# EAGLE schematic EARM01 (EAGLE 7.2.0)

## Sheet 1 of 2
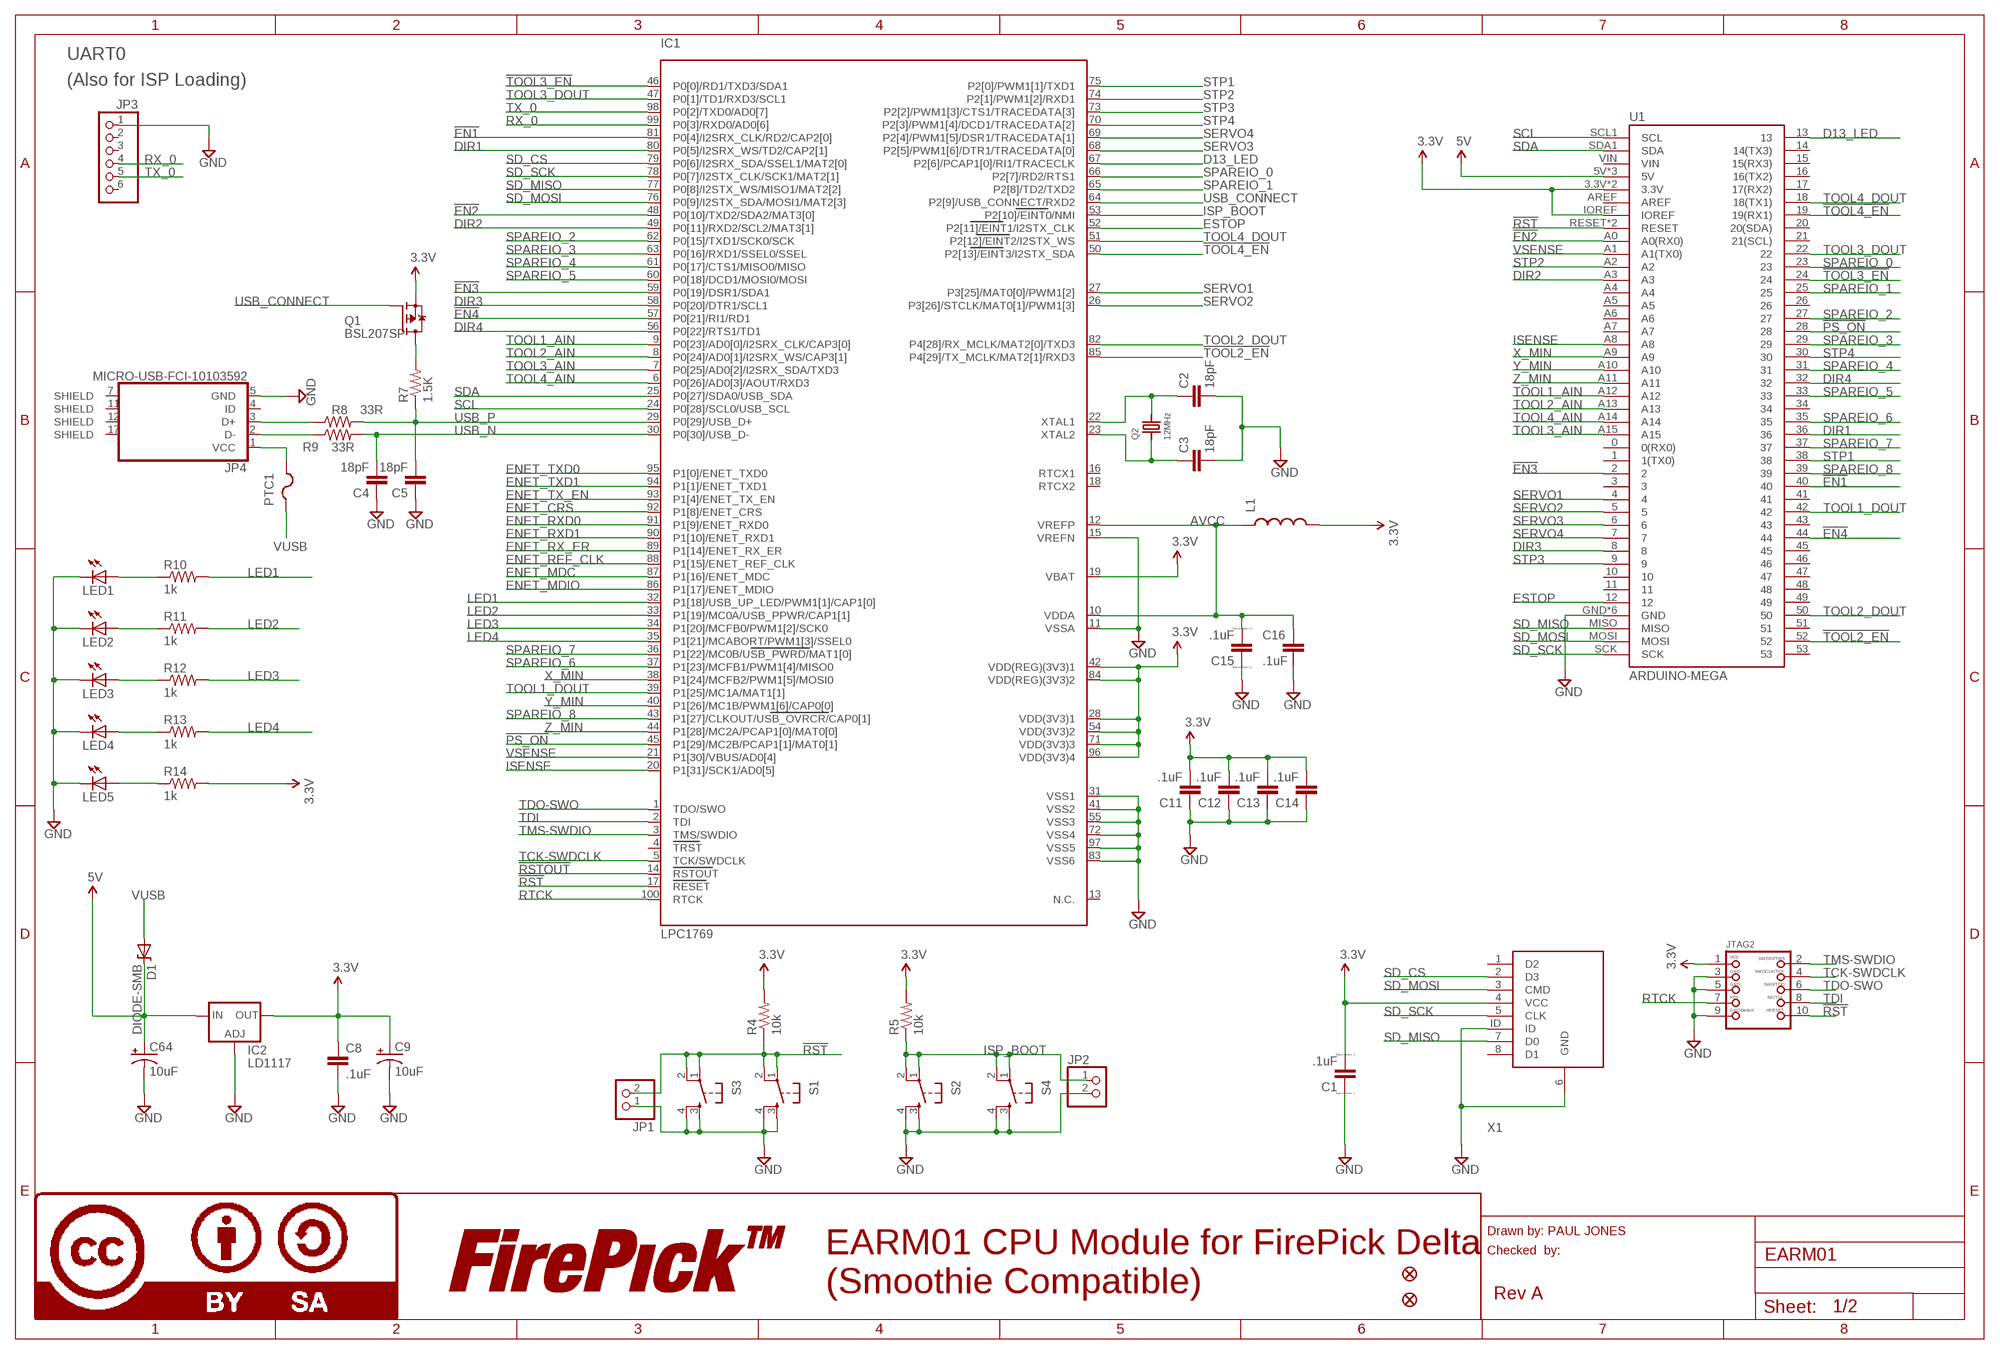
[diagram p0: schematic, sheet 1]

### Parts
C1  .1uF  C-EUC0603  [C0603]
C2  18pF  C-EUC0603  [C0603]
C3  18pF  C-EUC0603  [C0603]
C4  18pF  C-EUC0603  [C0603]
C5  18pF  C-EUC0603  [C0603]
C8  .1uF  C-EUC0603  [C0603]
C9  10uF  CAP_POL1206  [EIA3216]
C11  .1uF  C-EUC0603  [C0603]
C12  .1uF  C-EUC0603  [C0603]
C13  .1uF  C-EUC0603  [C0603]
C14  .1uF  C-EUC0603  [C0603]
C15  .1uF  C-EUC0603  [C0603]
C16  .1uF  C-EUC0603  [C0603]
C64  10uF  CAP_POL1206  [EIA3216]
D1  DIODE-SMB  DIODE-ZENERSMB  [SMB-DIODE]
FID5  FIDUCIAL1X2  [FIDUCIAL-1X2]
FID6  FIDUCIAL1X2  [FIDUCIAL-1X2]
IC1  LPC1769  LPC1768  [LQFP100]
IC2  LD1117  LD117AS12TR  [SOT223]
JP1  PINHD-1X2  [1X02]
JP2  PINHD-1X2  [1X02]
JP3  PINHD-1X6  [1X06]
JP4  MICRO-USB-FCI-10103592  [MICRO-USB-FCI-10103592]
JTAG2  JTAG-CORTEXM3  [2X05_1.27MM_SMT]
L1  INDUCTOR0603  [0603]
LED1  LED  [LED-1206-BOTTOM]
LED2  LED  [LED-1206-BOTTOM]
LED3  LED  [LED-1206-BOTTOM]
LED4  LED  [LED-1206-BOTTOM]
LED5  LED  [LED-1206-BOTTOM]
LOGO4  LOGO-FIREPICKMEDIUM  [LOGO-FIREPICK-MEDIUM]
LOGO6  LOGO-CC-BY-SAMEDIUM  [LOGO-CC-BY-SA-MEDIUM]
PTC1  PTCFUSE-1812  [1812]
Q1  BSL207SP  [SC74_INFINEON]
Q2  12MHz  CRYSTALTHIN  [CRYSTAL_3.2X2.5]
R4  10k  R-US_R0603  [R0603]
R5  10k  R-US_R0603  [R0603]
R7  1.5K  R-US_R0603  [R0603]
R8  33R  R-US_R0603  [R0603]
R9  33R  R-US_R0603  [R0603]
R10  1k  R-US_R0603  [R0603]
R11  1k  R-US_R0603  [R0603]
R12  1k  R-US_R0603  [R0603]
R13  1k  R-US_R0603  [R0603]
R14  1k  R-US_R0603  [R0603]
S1  TAC_SWITCHSMD  [TACTILE_SWITCH_SMD]
S2  TAC_SWITCHSMD  [TACTILE_SWITCH_SMD]
S3  TAC_SWITCHSMD  [TACTILE_SWITCH_SMD]
S4  TAC_SWITCHSMD  [TACTILE_SWITCH_SMD]
U1  ARDUINO-MEGA  [ARDUINO_MEGA_NEW]
X1  ST9S008V4AR1500  [ST9S008V4AR1500]

### Nets
3.3V: C1.2 C8.1 C9.A(+) C11.2 C12.2 C13.2 C14.2 IC1.19(VBAT) IC1.28(VDD(3V3)1) IC1.42(VDD(REG)(3V3)1) IC1.54(VDD(3V3)2) IC1.71(VDD(3V3)3) IC1.84(VDD(REG)(3V3)2) IC1.96(VDD(3V3)4) IC2.4(OUT) JTAG2.1 L1.2 Q1.4(S) R4.2 R5.2 R14.2 U1.3.3V U1.IOREF U1.VCC(3.3V) X1.4(VCC) ; also sheet 2
5V: C64.A(+) D1.C IC2.3(IN) U1.5V U1.5V@1(5V) U1.5V@2(5V)
!EN1: IC1.81(P0[4]/I2SRX_CLK/RD2/CAP2[0]) U1.40
!EN2: IC1.48(P0[10]/TXD2/SDA2/MAT3[0]) U1.A0(A0(RX0))
!EN3: IC1.59(P0[19]/DSR1/SDA1) U1.2
!EN4: IC1.57(P0[21]/RI1/RD1) U1.44
!PS_ON: IC1.45(P1[29]/MC2B/PCAP1[1]/MAT0[1]) U1.28
!RST: IC1.17(RESET) JP1.2 JTAG2.10 R4.1 S1.1 S1.2 S3.1 S3.2 U1.RESET U1.RST(RESET)
!RSTOUT: IC1.14(RSTOUT) ; also sheet 2
!TOOL2_EN: IC1.85(P4[29]/TX_MCLK/MAT2[1]/RXD3) U1.52
!TOOL3_EN: IC1.46(P0[0]/RD1/TXD3/SDA1) U1.24
!TOOL4_EN: IC1.50(P2[13]/EINT3/I2STX_SDA) U1.19(19(RX1))
AVCC: C15.2 C16.1 IC1.10(VDDA) IC1.12(VREFP) L1.1
D13_LED: IC1.67(P2[6]/PCAP1[0]/RI1/TRACECLK) U1.13
DIR1: IC1.80(P0[5]/I2SRX_WS/TD2/CAP2[1]) U1.36
DIR2: IC1.49(P0[11]/RXD2/SCL2/MAT3[1]) U1.A3
DIR3: IC1.58(P0[20]/DTR1/SCL1) U1.8
DIR4: IC1.56(P0[22]/RTS1/TD1) U1.32
ENET_CRS: IC1.92(P1[8]/ENET_CRS) ; also sheet 2
ENET_MDC: IC1.87(P1[16]/ENET_MDC) ; also sheet 2
ENET_MDIO: IC1.86(P1[17]/ENET_MDIO) ; also sheet 2
ENET_REF_CLK: IC1.88(P1[15]/ENET_REF_CLK) ; also sheet 2
ENET_RX_ER: IC1.89(P1[14]/ENET_RX_ER) ; also sheet 2
ENET_RXD0: IC1.91(P1[9]/ENET_RXD0) ; also sheet 2
ENET_RXD1: IC1.90(P1[10]/ENET_RXD1) ; also sheet 2
ENET_TX_EN: IC1.93(P1[4]/ENET_TX_EN) ; also sheet 2
ENET_TXD0: IC1.95(P1[0]/ENET_TXD0) ; also sheet 2
ENET_TXD1: IC1.94(P1[1]/ENET_TXD1) ; also sheet 2
ESTOP: IC1.52(P2[11]/EINT1/I2STX_CLK) U1.12
GND: C1.1 C2.2 C3.2 C4.1 C5.1 C8.2 C9.C(-) C11.1 C12.1 C13.1 C14.1 C15.1 C16.2 C64.C(-) IC1.11(VSSA) IC1.15(VREFN) IC1.31(VSS1) IC1.41(VSS2) IC1.55(VSS3) IC1.72(VSS4) IC1.83(VSS6) IC1.97(VSS5) IC2.1(ADJ) JP1.1 JP2.2 JP3.1 JP4.5(GND) JTAG2.3 JTAG2.5 JTAG2.9 LED1.C LED2.C LED3.C LED4.C LED5.C S1.3 S1.4 S2.3 S2.4 S3.3 S3.4 S4.3 S4.4 U1.GND U1.GND@0(GND) U1.GND@1(GND) U1.GND@2(GND) U1.GND@3(GND) U1.GNDI(GND) X1.6(GND) X1.ID ; also sheet 2
ISENSE: IC1.20(P1[31]/SCK1/AD0[5]) U1.A8
ISP_BOOT: IC1.53(P2[10]/EINT0/NMI) JP2.1 R5.1 S2.1 S2.2 S4.1 S4.2
LED1: IC1.32(P1[18]/USB_UP_LED/PWM1[1]/CAP1[0]) R10.2
LED2: IC1.33(P1[19]/MC0A/USB_PPWR/CAP1[1]) R11.2
LED3: IC1.34(P1[20]/MCFB0/PWM1[2]/SCK0) R12.2
LED4: IC1.35(P1[21]/MCABORT/PWM1[3]/SSEL0) R13.2
N$1: C2.1 IC1.22(XTAL1) Q2.2
N$2: C3.1 IC1.23(XTAL2) Q2.1
N$9: JP4.1(VCC) PTC1.2
N$51: Q1.1(D) Q1.2(D) Q1.5(D) Q1.6(D) R7.2
N$61: JP4.3(D+) R8.1
N$62: JP4.2(D-) R9.1
N$80: LED5.A R14.1
N$84: LED4.A R13.1
N$85: LED3.A R12.1
N$86: LED2.A R11.1
N$87: LED1.A R10.1
RTCK: IC1.100(RTCK) JTAG2.7
RX_0: IC1.99(P0[3]/RXD0/AD0[6]) JP3.4
SCL: IC1.24(P0[28]/SCL0/USB_SCL) U1.SCL1(SCL)
SD_CS: IC1.79(P0[6]/I2SRX_SDA/SSEL1/MAT2[0]) X1.2(D3)
SD_MISO: IC1.77(P0[8]/I2STX_WS/MISO1/MAT2[2]) U1.MISO X1.7(D0)
SD_MOSI: IC1.76(P0[9]/I2STX_SDA/MOSI1/MAT2[3]) U1.MOSI X1.3(CMD)
SD_SCK: IC1.78(P0[7]/I2STX_CLK/SCK1/MAT2[1]) U1.SCK X1.5(CLK)
SDA: IC1.25(P0[27]/SDA0/USB_SDA) U1.SDA1(SDA)
SERVO1: IC1.27(P3[25]/MAT0[0]/PWM1[2]) U1.4
SERVO2: IC1.26(P3[26]/STCLK/MAT0[1]/PWM1[3]) U1.5
SERVO3: IC1.68(P2[5]/PWM1[6]/DTR1/TRACEDATA[0]) U1.6
SERVO4: IC1.69(P2[4]/PWM1[5]/DSR1/TRACEDATA[1]) U1.7
SPAREIO_0: IC1.66(P2[7]/RD2/RTS1) U1.23
SPAREIO_1: IC1.65(P2[8]/TD2/TXD2) U1.25
SPAREIO_2: IC1.62(P0[15]/TXD1/SCK0/SCK) U1.27
SPAREIO_3: IC1.63(P0[16]/RXD1/SSEL0/SSEL) U1.29
SPAREIO_4: IC1.61(P0[17]/CTS1/MISO0/MISO) U1.31
SPAREIO_5: IC1.60(P0[18]/DCD1/MOSI0/MOSI) U1.33
SPAREIO_6: IC1.37(P1[23]/MCFB1/PWM1[4]/MISO0) U1.35
SPAREIO_7: IC1.36(P1[22]/MC0B/USB_PWRD/MAT1[0]) U1.37
SPAREIO_8: IC1.43(P1[27]/CLKOUT/USB_OVRCR/CAP0[1]) U1.39
STP1: IC1.75(P2[0]/PWM1[1]/TXD1) U1.38
STP2: IC1.74(P2[1]/PWM1[2]/RXD1) U1.A2
STP3: IC1.73(P2[2]/PWM1[3]/CTS1/TRACEDATA[3]) U1.9
STP4: IC1.70(P2[3]/PWM1[4]/DCD1/TRACEDATA[2]) U1.30
TCK-SWDCLK: IC1.5(TCK/SWDCLK) JTAG2.4
TDI: IC1.2(TDI) JTAG2.8
TDO-SWO: IC1.1(TDO/SWO) JTAG2.6
TMS-SWDIO: IC1.3(TMS/SWDIO) JTAG2.2
TOOL1_AIN: IC1.9(P0[23]/AD0[0]/I2SRX_CLK/CAP3[0]) U1.A12
TOOL1_DOUT: IC1.39(P1[25]/MC1A/MAT1[1]) U1.42
TOOL2_AIN: IC1.8(P0[24]/AD0[1]/I2SRX_WS/CAP3[1]) U1.A13
TOOL2_DOUT: IC1.82(P4[28]/RX_MCLK/MAT2[0]/TXD3) U1.50
TOOL3_AIN: IC1.7(P0[25]/AD0[2]/I2SRX_SDA/TXD3) U1.A15
TOOL3_DOUT: IC1.47(P0[1]/TD1/RXD3/SCL1) U1.22
TOOL4_AIN: IC1.6(P0[26]/AD0[3]/AOUT/RXD3) U1.A14
TOOL4_DOUT: IC1.51(P2[12]/EINT2/I2STX_WS) U1.18(18(TX1))
TX_0: IC1.98(P0[2]/TXD0/AD0[7]) JP3.5
USB_CONNECT: IC1.64(P2[9]/USB_CONNECT/RXD2) Q1.3(G)
USB_N [USB]: C4.2 IC1.30(P0[30]/USB_D-) R9.2
USB_P [USB]: C5.2 IC1.29(P0[29]/USB_D+) R7.1 R8.2
VSENSE: IC1.21(P1[30]/VBUS/AD0[4]) U1.A1(A1(TX0))
VUSB: D1.A PTC1.1
X_MIN: IC1.38(P1[24]/MCFB2/PWM1[5]/MOSI0) U1.A9
Y_MIN: IC1.40(P1[26]/MC1B/PWM1[6]/CAP0[0]) U1.A10
Z_MIN: IC1.44(P1[28]/MC2A/PCAP1[0]/MAT0[0]) U1.A11
Unconnected: IC1.4(TRST) IC1.13(N.C.) IC1.16(RTCX1) IC1.18(RTCX2) JP3.2 JP3.3 JP3.6 JP4.4(ID) JP4.7(SHIELD) JP4.11(SHIELD) JP4.12(SHIELD) JP4.17(SHIELD) U1.0(0(RX0)) U1.1(1(TX0)) U1.3 U1.10 U1.11 U1.14(14(TX3)) U1.15(15(RX3)) U1.16(16(TX2)) U1.17(17(RX2)) U1.20(20(SDA)) U1.21(21(SCL)) U1.26 U1.34 U1.41 U1.43 U1.45 U1.46 U1.47 U1.48 U1.49 U1.51 U1.53 U1.A4 U1.A5 U1.A6 U1.A7 U1.AREF U1.VIN X1.1(D2) X1.8(D1)

### Notes on the sheet
- UART0
- (Also for ISP Loading)
- Drawn by: PAUL JONES
- Checked  by:
- EARM01 CPU Module for FirePick Delta
  (Smoothie Compatible)
- Rev A

## Sheet 2 of 2
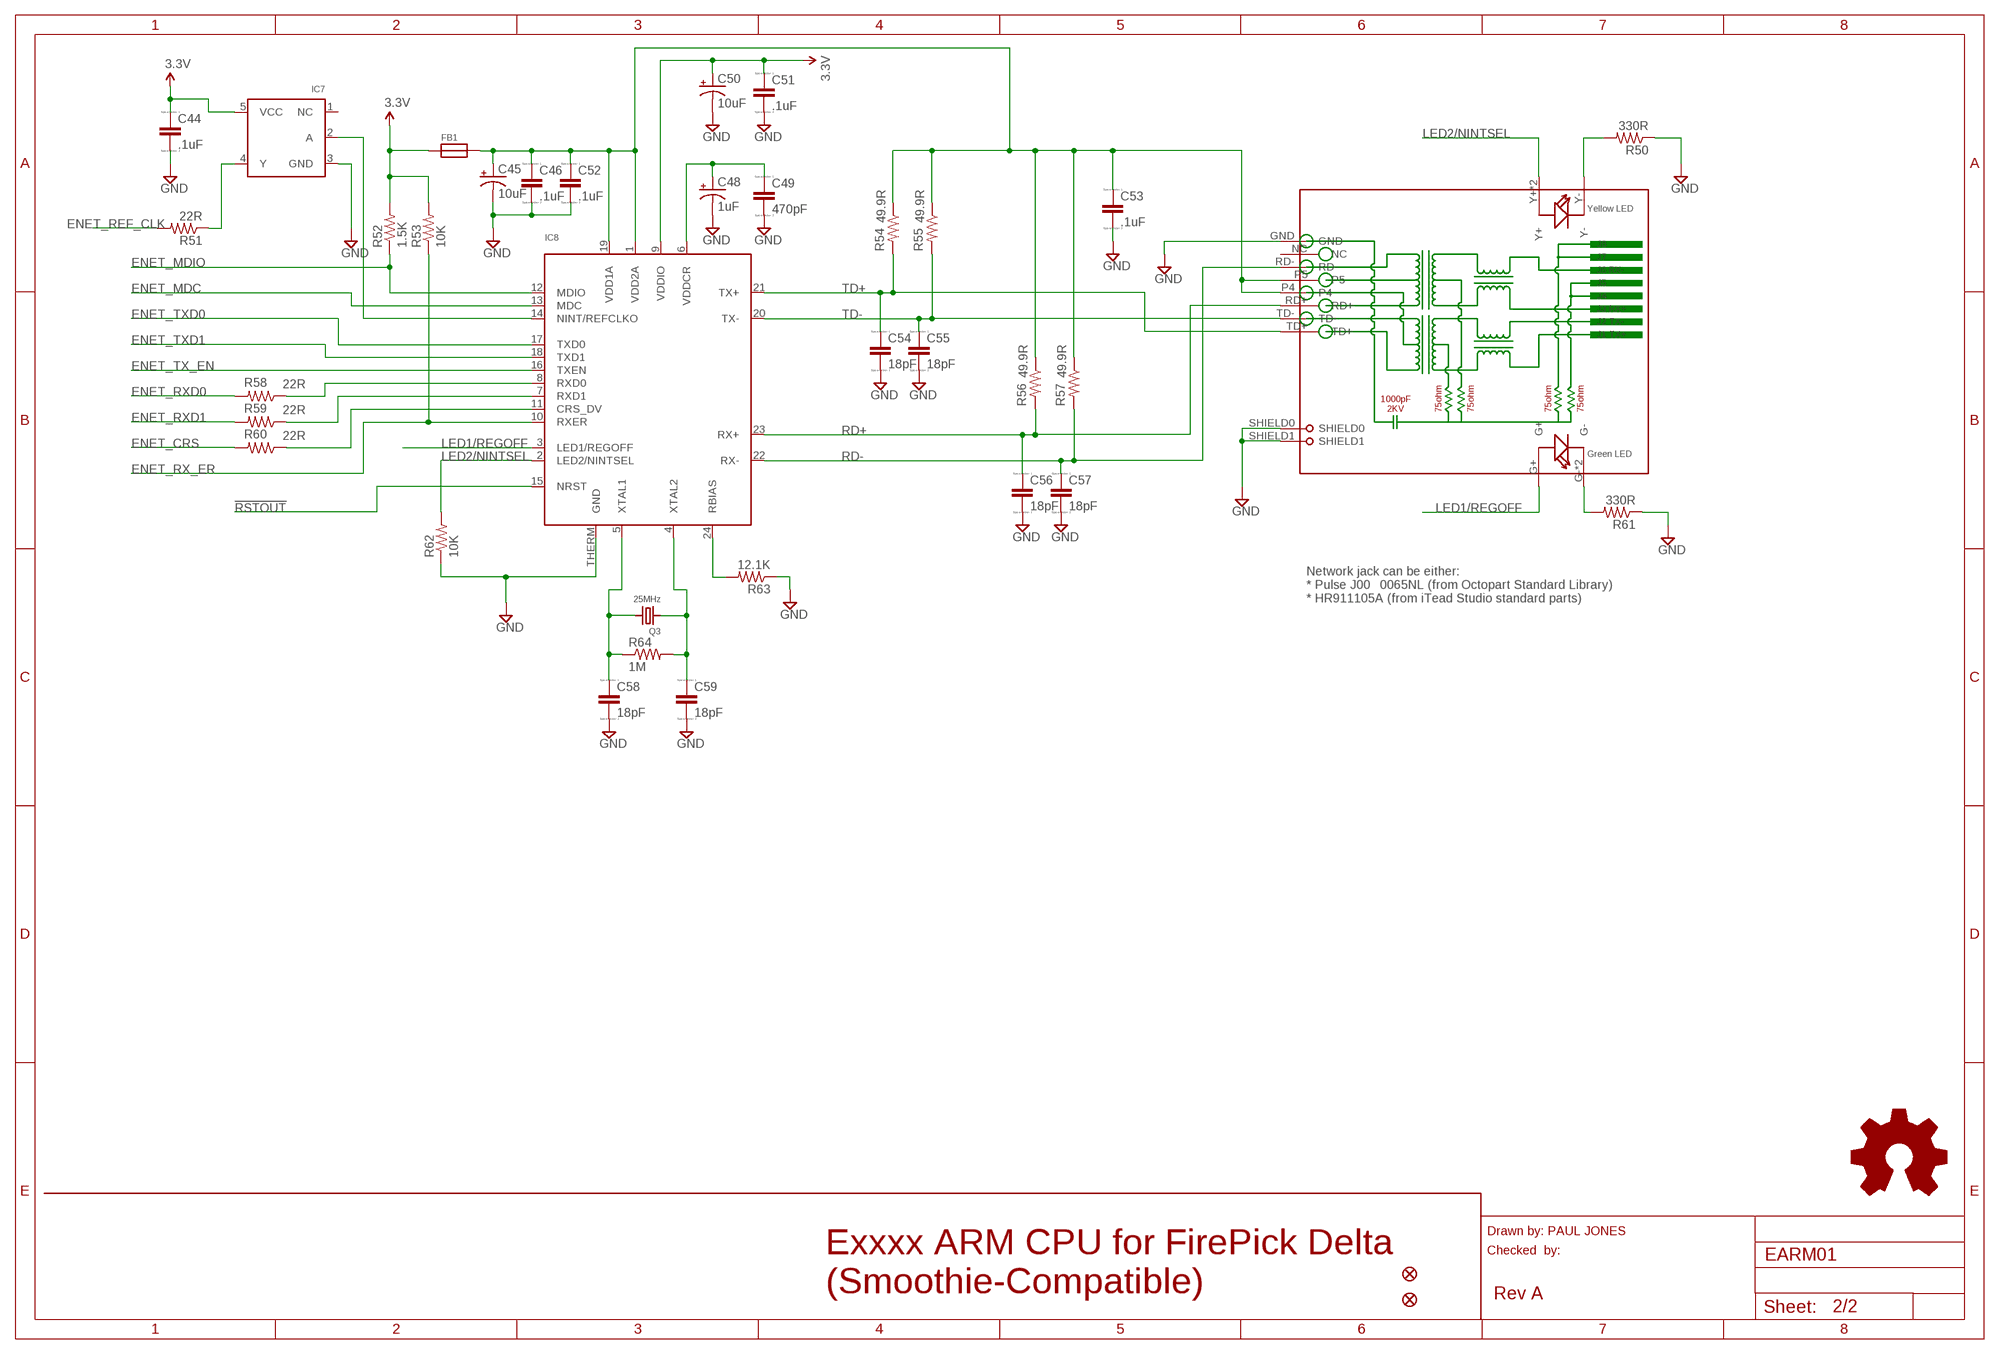
[diagram p1: schematic, sheet 2]

### Parts
C44  .1uF  C-EUC0603  [C0603]
C45  10uF  CAP_POL1206  [EIA3216]
C46  .1uF  C-EUC0603  [C0603]
C48  1uF  CAP_POL1206  [EIA3216]
C49  470pF  C-EUC0603K  [C0603K]
C50  10uF  CAP_POL1206  [EIA3216]
C51  .1uF  C-EUC0603  [C0603]
C52  .1uF  C-EUC0603  [C0603]
C53  .1uF  C-EUC0603  [C0603]
C54  18pF  C-EUC0603  [C0603]
C55  18pF  C-EUC0603  [C0603]
C56  18pF  C-EUC0603  [C0603]
C57  18pF  C-EUC0603  [C0603]
C58  18pF  C-EUC0603  [C0603]
C59  18pF  C-EUC0603  [C0603]
FB1  FERRITE  [0603]
FID17  FIDUCIAL1X2  [FIDUCIAL-1X2]
FID18  FIDUCIAL1X2  [FIDUCIAL-1X2]
IC7  74LVC1G04  [SOT23-5]
IC8  LAN8720  [QFN24_4MM]
LOGO10  LOGO-OSHWSMALL  [LOGO-OSHW-SMALL]
Q3  25MHz  CRYSTALTHIN  [CRYSTAL_3.2X2.5]
R50  330R  R-US_R0603  [R0603]
R51  22R  R-US_R0603  [R0603]
R52  1.5K  R-US_R0603  [R0603]
R53  10K  R-US_R0603  [R0603]
R54  49.9R  R-US_R0603  [R0603]
R55  49.9R  R-US_R0603  [R0603]
R56  49.9R  R-US_R0603  [R0603]
R57  49.9R  R-US_R0603  [R0603]
R58  22R  R-US_R0603  [R0603]
R59  22R  R-US_R0603  [R0603]
R60  22R  R-US_R0603  [R0603]
R61  330R  R-US_R0603  [R0603]
R62  10K  R-US_R0603  [R0603]
R63  12.1K  R-US_R0603  [R0603]
R64  1M  R-US_R0603  [R0603]
RJ1  HR911105A  [HR911105A]

### Nets
3.3V: C44.1 C50.A(+) C51.1 FB1.1 IC7.5(VCC) IC8.9(VDDIO) R52.2 R53.2 ; also sheet 1
!RSTOUT: IC8.15(NRST) ; also sheet 1
ENET_CRS: R60.2 ; also sheet 1
ENET_MDC: IC8.13(MDC) ; also sheet 1
ENET_MDIO: IC8.12(MDIO) R52.1 ; also sheet 1
ENET_REF_CLK: R51.2 ; also sheet 1
ENET_RX_ER: IC8.10(RXER) R53.1 ; also sheet 1
ENET_RXD0: R58.2 ; also sheet 1
ENET_RXD1: R59.2 ; also sheet 1
ENET_TX_EN: IC8.16(TXEN) ; also sheet 1
ENET_TXD0: IC8.17(TXD0) ; also sheet 1
ENET_TXD1: IC8.18(TXD1) ; also sheet 1
GND: C44.2 C45.C(-) C46.2 C48.C(-) C49.2 C50.C(-) C51.2 C52.2 C53.2 C54.2 C55.2 C56.2 C57.2 C58.2 C59.2 IC7.3(GND) IC8.THERM(GND) R50.1 R61.1 R62.1 R63.1 RJ1.GND RJ1.SHIELD0 RJ1.SHIELD1 ; also sheet 1
LED1/REGOFF: IC8.3(LED1/REGOFF) RJ1.G+
LED2/NINTSEL: IC8.2(LED2/NINTSEL) R62.2 RJ1.Y+ RJ1.Y++(Y+)
N$3: IC8.11(CRS_DV) R60.1
N$4: IC8.24(RBIAS) R63.2
N$12: C48.A(+) C49.1 IC8.6(VDDCR)
N$15: IC7.2(A) IC8.14(NINT/REFCLKO)
N$20: R61.2 RJ1.G- RJ1.G--(G-)
N$42: IC8.8(RXD0) R58.1
N$47: R50.2 RJ1.Y-
N$55: IC8.7(RXD1) R59.1
N$67: C59.1 IC8.4(XTAL2) Q3.1 R64.2
N$68: C58.1 IC8.5(XTAL1) Q3.2 R64.1
N$78: IC7.4(Y) R51.1
RD+: C56.1 IC8.23(RX+) R56.2 RJ1.RD+
RD-: C57.1 IC8.22(RX-) R57.2 RJ1.RD-
TD+: C54.1 IC8.21(TX+) R54.2 RJ1.TD+
TD-: C55.1 IC8.20(TX-) R55.2 RJ1.TD-
VDD: C45.A(+) C46.1 C52.1 C53.1 FB1.2 IC8.1(VDD2A) IC8.19(VDD1A) R54.1 R55.1 R56.1 R57.1 RJ1.P4 RJ1.P5
Unconnected: IC7.1(NC) RJ1.NC

### Notes on the sheet
- Network jack can be either:
  * Pulse J00‑0065NL (from Octopart Standard Library)
  * HR911105A (from iTead Studio standard parts)
- Drawn by: PAUL JONES
- Checked  by:
- Exxxx ARM CPU for FirePick Delta
  (Smoothie-Compatible)
- Rev A

## Library data of the parts
C1 C15 C44 C46 C49 C51-C59 = resistor:C-EU: CAPACITOR, European symbol; SPICEPREFIX: C
C2-C5 C8 C11-C14 C16 = rcl:C-EU: CAPACITOR, European symbol
C9 C45 C48 C50 C64 = SparkFun:CAP_POL: Capacitor Polarized These are standard SMD and PTH capacitors. Normally 10uF, 47uF, and 100uF in electrolytic and tantalum varieties. Always verify the external diameter of the through hole cap, it varies with capacity, voltage, and manufacturer. The EIA devices should be standard.
D1 = iwt:DIODE-ZENER: Zener Diode Production Part - 8199 3.4V Zener Voltage
FB1 = microbuilder:FERRITE: Ferrite Bead 0603 MMZ1608B121C - 120 Ohm, 600mA Ferrite Chip - Digikey: 445-2164-1-ND BK1608HW121-T - 120 Ohm, 600mA Ferrite Chip - Digikey: 587-1876-2-ND
FID5 FID6 FID17 FID18 = SparkFun-Aesthetics:FIDUCIAL: Fiducial Alignment Points Various fiducial points for machine vision alignment.
IC1 = microbuilder:LPC1768: LPC1768 100 MHz 32-bit ARM Cortex-M3 based microcontroller featuring a high level of integration and low power consumption. 512 kB Flash, 64 kB SRAM, USB Device/Host/OTG, Ethernet, CAN, I2S, 10-bit DAC Digikey: 568-4796-ND
IC2 = v-reg:LD117A?*: Low drop fixed and adjustable positive voltage regulators 1 A Source: http://www.st.com/stonline/products/literature/ds/7194/ld1117axx.pdf
IC7 = microbuilder:74LVC1G04: 74LVC1G04 - Single Inverter Gate SOT23-5 SN74LVC1G04DBVR - Digikey: 296-11599-1-ND
IC8 = microbuilder:LAN8720: LAN8720A 10/100 Ethernet PHY Mouser: 886-LAN8720AI-CP
JP1 JP2 = pinhead:PINHD-1X2: PIN HEADER
JP3 = pinhead:PINHD-1X6: PIN HEADER
JP4 = micro-usb-fci-10103592:MICRO-USB-FCI-10103592: USB Micro-B Plug Comes in a variety of packages. Check out Hirose's ZX-x0 line: http://www.hirose.co.jp/cataloge_hp/e24200011.pdf
JTAG2 = microbuilder:JTAG-CORTEXM3: Serial Wire (SW-DP) Connector This standard 0.05" 10-pin connector is for use with the Cortex M0/M3's native SWD (serial wire debugger) interface (SW-DP). Some boards support a 20-pin combined JTAG+SWD connector (SWJ-DP), such as the LPC1700 family, but many smaller devices only work with SWD which typically use the smaller 10-pin SW-DP connecter (the LPC1300 family, for example, only supports SWD). 2x05 1.27mm/0.05" Connector: This is the standard SMT connector defined by ARM for all Cortex devices, and should be used in most situations and for forward-compatibility since any new devices coming to market will likely use this connector. MOLEX 10 Pin 0.1" Connector: This 0.1" 10 pin connector has the same pin layout as the standard 0.05" connector, but is easier to work with if you are using standard jumper wires or custom cables to connect your SWD hardware. MOLEX 20 Pin 0.1" Connector: This 0.1" 20 pin connector is the same model used for ARM7/ARM9 JTAG debuggers, but is connected to match the pins on the Segger J-Link for ARM (which supports both JTAG and SWD debugging). See the following document from ARM for more information on Cortex M3 Debug Connectors: http://infocenter.arm.com/help/topic/com.arm.doc.faqs/attached/13634/cortex_debug_connectors.pdf And the following page for an overview with images of the different connector types: http://www.keil.com/peripherals/coresight/connectors.asp
L1 = SparkFun:INDUCTOR: Inductors Basic Inductor/Choke - 0603 and 1206. Footprints are not proven and vary greatly between part numbers.
LED1-LED5 = iwt:LED: LEDs Standard schematic elements and footprints for 5mm, 3mm, 1206, and 0603 sized LEDs. 5mm - Spark Fun Electronics SKU : COM-00529 (and others)
LOGO4 = FirePick:LOGO-FIREPICK
LOGO6 = FirePick:LOGO-CC-BY-SA
LOGO10 = FirePick:LOGO-OSHW
PTC1 = adafruit:PTCFUSE: PTC fuses, resettable thermistors
Q1 = transistor-fet:BSL207SP: OptiMOS(R)-P Small-Signal-Transistor P-Channel, Enhancement mode, Super Logic Level (2.5 V rated) Source: http://www.infineon.com/upload/Document/BSL207SP_Rev2.01.pdf
Q2 Q3 = microbuilder:CRYSTAL: Crystals HC49UP - Surface Mount Crystal 4.0MHz 18pF +/-30ppm Surface Mount Crystal [Digikey: 535-9857-1-ND] 12.0 MHz Surface Mount Crystal [Digikey: 535-9869-6-ND] 25.0 MHz Surface Mount Crystal [Digikey: 535-9078-1-ND] 3.2 x 2.5mm - MEMs SMT Crystal 12.0 MHz 8pF 15ppm 3.2 x 2.5mm Crystal [Digikey: -10-70°C: 644-1047-1-ND -40-125°C: 644-1128-1-ND] 16.0 MHz 8pF 15ppm 3.2 x 2.5mm Crystal [Digikey: -10-70°C: 644-1049-1-ND -40-125°C: 644-1129-2-ND] 16.0 MHz 10pF 10ppm 3.2 x 2.5mm Crystal [Digikey: 644-1100-1-ND] 27.12 MHz 18pF 30ppm 3.2 x 2.5mm Crystal [Digikey: 887-1424-1-ND] 27.12MHz 10pF 10ppm 3.2 x 2.5mm Crystal [Digikey: 887-1329-1-ND] 4.9 x 1.8mm - MEMs SMT Crystal 32.768 KHz 12.5pF 20ppm 4.9 x 1.8mm Crystal [Digikey: SE2415CT-ND] Cylinder 32.768KHz Cylinder Crystal
R4 R5 R7-R14 R50-R64 = resistor:R-US_: RESISTOR, American symbol
RJ1 = FirePick:HR911105A: SOC006
S1-S4 = SparkFun:TAC_SWITCH: Momentary Switch Button commonly used for reset or general input. Spark Fun Electronics SKU : COM-00097
U1 = iwt:ARDUINO-MEGA: Arduino Mega board footprint
X1 = ST9S008V4AR1500-598396:ST9S008V4AR1500: http://octopart.com/st9s008v4ar1500-jae+electronics-19043725

## Net classes
1 USB: width 0.305 mm, drill 0.381 mm, clearance 0.254 mm